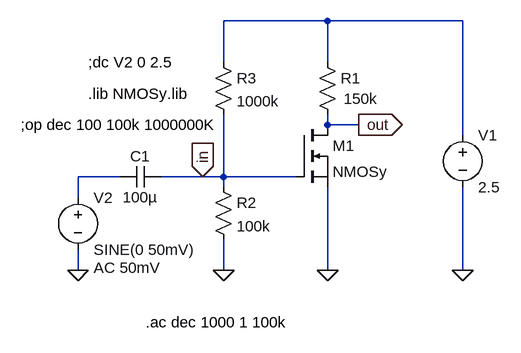
[diagram p0: schematic Draft4.asc]
Draft4.asc, the LTspice schematic file:
Version 4
SHEET 1 880 680
WIRE 304 -32 144 -32
WIRE 512 -32 304 -32
WIRE 144 32 144 -32
WIRE 304 32 304 -32
WIRE 304 128 304 112
WIRE 352 128 304 128
WIRE 512 144 512 -32
WIRE -16 208 -80 208
WIRE 112 208 48 208
WIRE 144 208 144 112
WIRE 144 208 112 208
WIRE 256 208 144 208
WIRE 144 224 144 208
WIRE -80 240 -80 208
WIRE -80 352 -80 320
WIRE 144 352 144 304
WIRE 304 352 304 224
WIRE 512 352 512 224
FLAG 304 352 0
FLAG 512 352 0
FLAG 352 128 out
IOPIN 352 128 Out
FLAG 112 208 in
IOPIN 112 208 In
FLAG 144 352 0
FLAG -80 352 0
SYMBOL nmos 256 128 R0
SYMATTR InstName M1
SYMATTR Value NMOSy
SYMBOL voltage 512 128 R0
SYMATTR InstName V1
SYMATTR Value 2.5
SYMBOL res 288 16 R0
WINDOW 3 41 72 Left 2
SYMATTR Value 150k
SYMATTR InstName R1
SYMBOL voltage -80 224 R0
WINDOW 123 24 124 Left 2
WINDOW 39 0 0 Left 0
SYMATTR Value2 AC 50mV
SYMATTR InstName V2
SYMATTR Value SINE(0 50mV)
SYMBOL res 128 208 R0
SYMATTR InstName R2
SYMATTR Value 100k
SYMBOL res 128 16 R0
SYMATTR InstName R3
SYMATTR Value 1000k
SYMBOL cap -16 192 M90
WINDOW 0 0 32 VBottom 2
WINDOW 3 32 32 VTop 2
SYMATTR InstName C1
SYMATTR Value 100µ
TEXT -64 80 Left 2 !.lib NMOSy.lib
TEXT -64 32 Left 2 !;dc V2 0 2.5
TEXT -168 128 Left 2 !;op dec 100 100k 1000000K
TEXT 24 432 Left 2 !.ac dec 1000 1 100k

The netlist it stands for:
* Draft4.asc
M1 out in 0 0 NMOSy
V1 N001 0 2.5
R1 N001 out 150k
V2 N002 0 SINE(0 50mV) AC 50mV
R2 in 0 100k
R3 N001 in 1000k
C1 N002 in 100µ
.model NMOS NMOS
.model PMOS PMOS
.lib standard.mos
.lib NMOSy.lib
;dc V2 0 2.5
;op dec 100 100k 1000000K
.ac dec 1000 1 100k
.backanno
.end